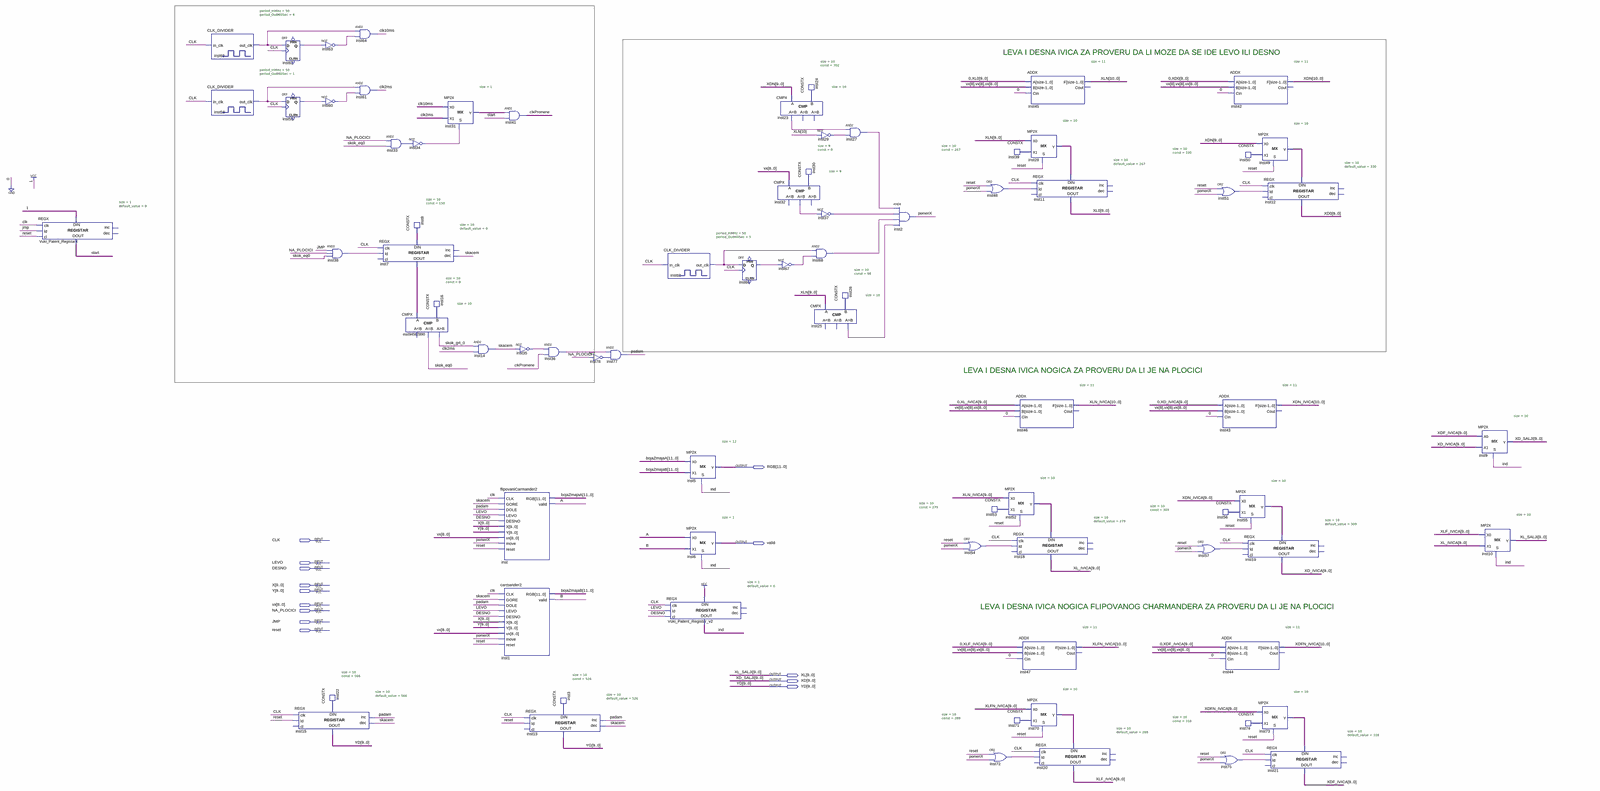
[diagram p0: schematic sheet, whole]
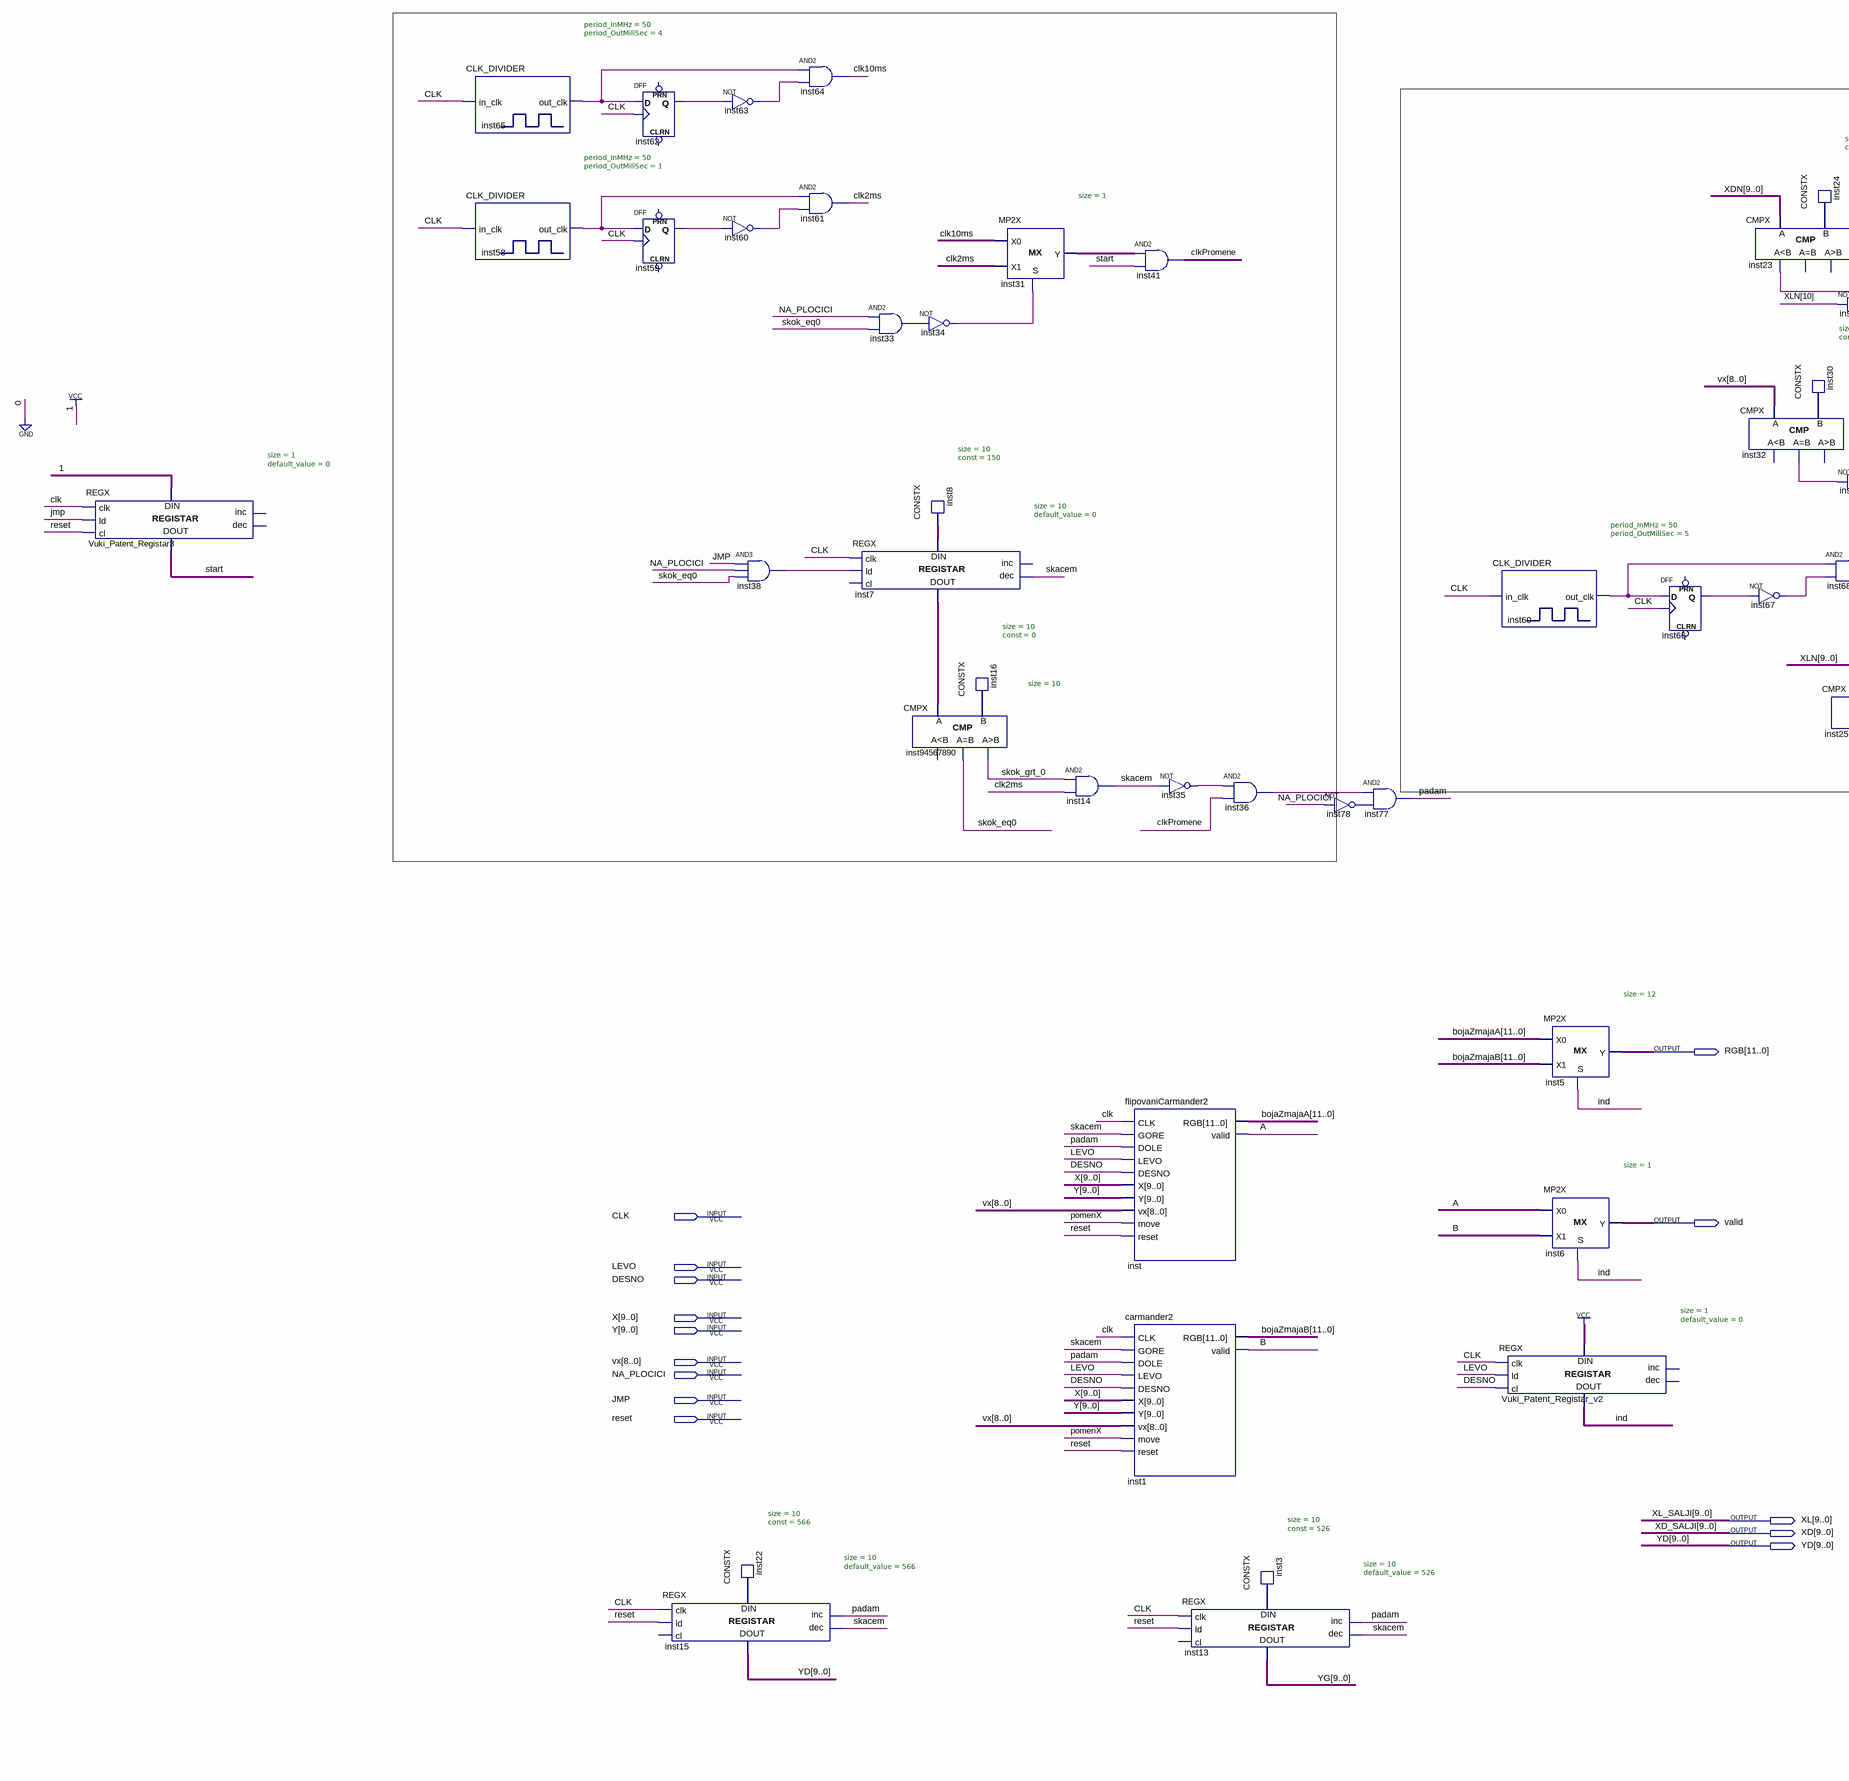
[diagram p1: schematic sheet, left part]
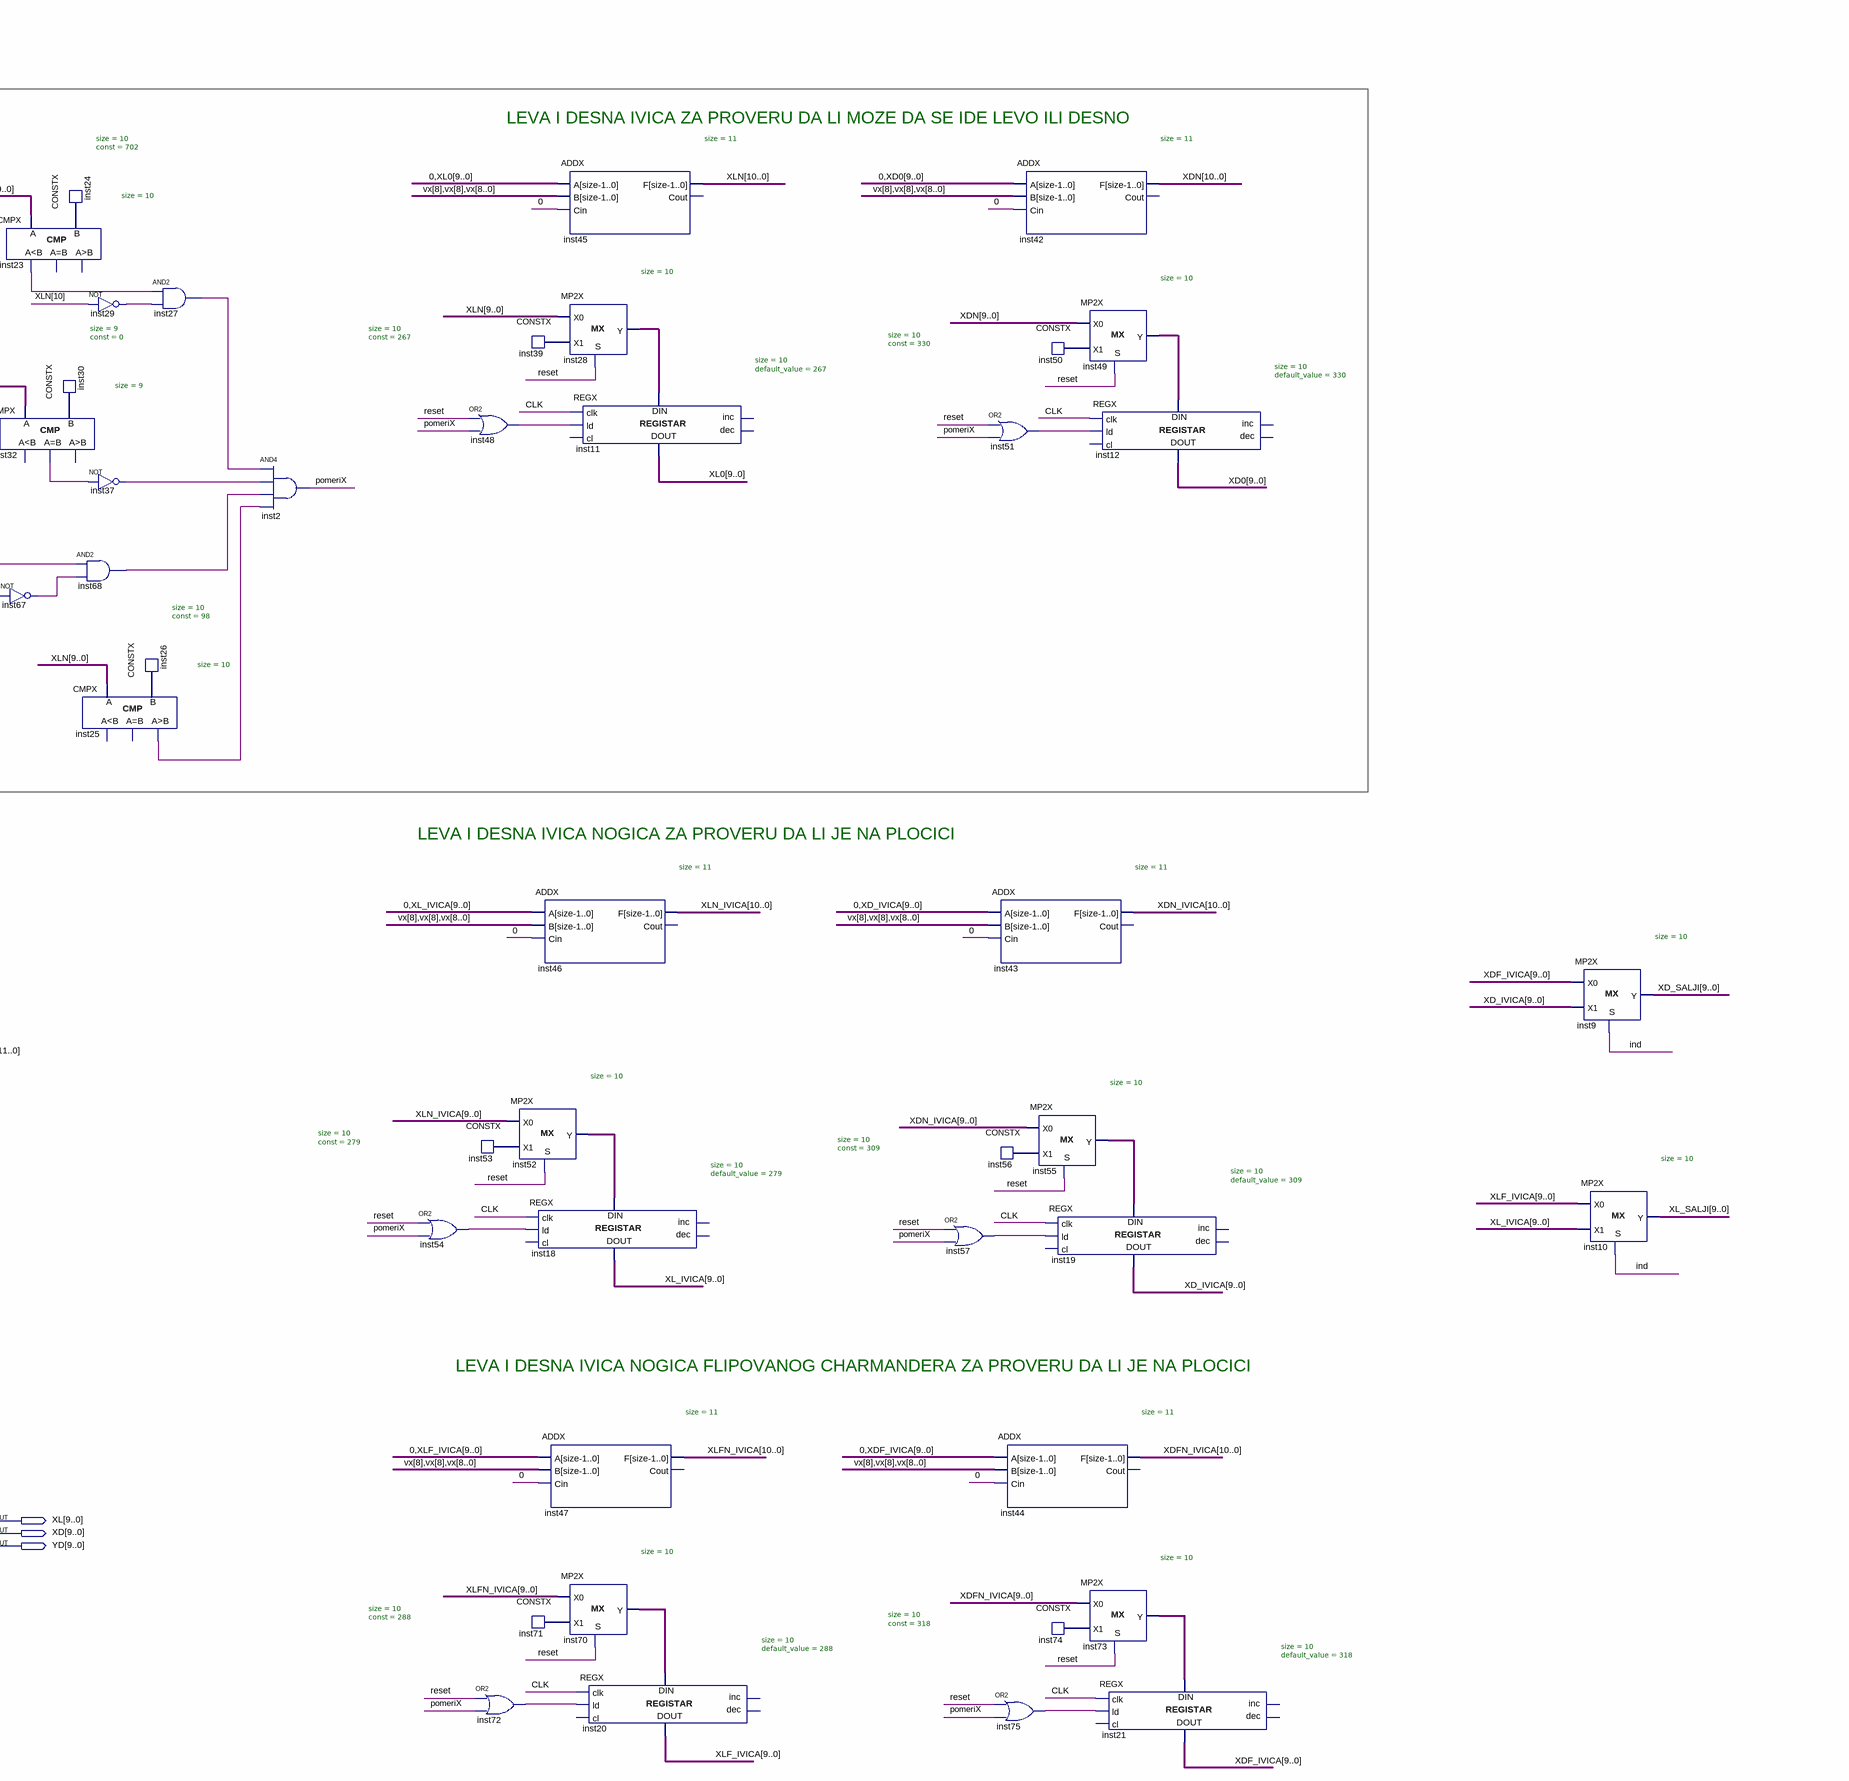
[diagram p2: schematic sheet, right part]
// Quartus schematic carmanderLevoDesno2.bdf as structural Verilog: 78 symbols, 14 pins
module carmanderLevoDesno2 (
  input  CLK,
  input  LEVO,
  input  DESNO,
  input  [9:0] X,
  input  [9:0] Y,
  input  [8:0] vx,
  input  NA_PLOCICI,
  input  JMP,
  input  reset,
  output [11:0] RGB,
  output valid,
  output [9:0] XL,
  output [9:0] XD,
  output [9:0] YD
);

  wire A, B, clk2ms, clk10ms, clkPromene, ind, inst23_ls, inst25_gr, inst27_out, inst29_out, inst31_y,
       inst32_eq, inst33_out, inst34_out, inst35_out, inst36_out, inst37_out, inst38_out, inst48_out,
       inst51_out, inst54_out, inst57_out, inst58_out_clk, inst59_q, inst60_out, inst62_q, inst63_out,
       inst65_out_clk, inst66_q, inst67_out, inst68_out, inst69_out_clk, inst72_out, inst75_out, inst78_out,
       padam, pomeriX, skacem, skok_eq0, skok_grt_0, start;
  wire [8:0] inst30_data;
  wire [9:0] inst3_data, inst7_data_out, inst8_data, inst16_data, inst22_data, inst24_data, inst26_data,
       inst28_y, inst39_data, inst49_y, inst50_data, inst52_y, inst53_data, inst55_y, inst56_data, inst70_y,
       inst71_data, inst73_y, inst74_data, XD0, XD_IVICA, XDF_IVICA, XL0, XL_IVICA, XLF_IVICA, YG;
  wire [10:0] XDFN_IVICA, XDN, XDN_IVICA, XLFN_IVICA, XLN, XLN_IVICA;
  wire [11:0] bojaZmajaA, bojaZmajaB;

  REGX #(.size(1), .default_value(0)) Vuki_Patent_Registar3 (
    .clk(CLK), .ld(JMP), .cl(reset), .data_in(1'b1), .data_out(start));  // open: inc, dec
  CLK_DIVIDER #(.period_InMHz(50), .period_OutMiliSec(4)) inst65 (.in_clk(CLK), .out_clk(inst65_out_clk));
  CLK_DIVIDER #(.period_InMHz(50), .period_OutMiliSec(1)) inst58 (.in_clk(CLK), .out_clk(inst58_out_clk));
  DFF inst62 (.CLK(CLK), .D(inst65_out_clk), .Q(inst62_q));  // open: CLRN, PRN
  DFF inst59 (.CLK(CLK), .D(inst58_out_clk), .Q(inst59_q));  // open: CLRN, PRN
  REGX #(.size(10), .default_value(566)) inst15 (
    .clk(CLK), .ld(reset), .inc(padam), .dec(skacem), .data_in(inst22_data), .data_out(YD));  // open: cl
  not inst63 (inst63_out, inst62_q);
  not inst60 (inst60_out, inst59_q);
  and inst38 (inst38_out, JMP, NA_PLOCICI, skok_eq0);
  CONSTX #(.size(10), .\const (566)) inst22 (.data(inst22_data));
  and inst64 (clk10ms, inst65_out_clk, inst63_out);
  and inst61 (clk2ms, inst58_out_clk, inst60_out);
  REGX #(.size(10), .default_value(0)) inst7 (
    .clk(CLK), .ld(inst38_out), .dec(skacem), .data_in(inst8_data), .data_out(inst7_data_out));  // open: cl, inc
  and inst33 (inst33_out, NA_PLOCICI, skok_eq0);
  CONSTX #(.size(10), .\const (150)) inst8 (.data(inst8_data));
  CMPX #(.size(10)) inst94567890 (.A(inst7_data_out), .B(inst16_data), .eq(skok_eq0), .gr(skok_grt_0));  // open: ls
  not inst34 (inst34_out, inst33_out);
  CONSTX #(.size(10), .\const (0)) inst16 (.data(inst16_data));
  MP2X #(.size(1)) inst31 (.S(inst34_out), .X0(clk10ms), .X1(clk2ms), .Y(inst31_y));
  and inst14 (skacem, skok_grt_0, clk2ms);
  and inst41 (clkPromene, inst31_y, start);
  not inst35 (inst35_out, skacem);
  flipovaniCarmander2 inst (
    .CLK(CLK), .GORE(skacem), .DOLE(padam), .LEVO(LEVO), .DESNO(DESNO), .X(X), .Y(Y), .vx(vx),
    .move(pomeriX), .reset(reset), .RGB(bojaZmajaA), .valid(A));
  carmander2 inst1 (
    .CLK(CLK), .GORE(skacem), .DOLE(padam), .LEVO(LEVO), .DESNO(DESNO), .X(X), .Y(Y), .vx(vx),
    .move(pomeriX), .reset(reset), .RGB(bojaZmajaB), .valid(B));
  REGX #(.size(10), .default_value(526)) inst13 (
    .clk(CLK), .ld(reset), .inc(padam), .dec(skacem), .data_in(inst3_data), .data_out(YG));  // open: cl
  and inst36 (inst36_out, inst35_out, clkPromene);
  CONSTX #(.size(10), .\const (526)) inst3 (.data(inst3_data));
  and inst77 (padam, inst36_out, inst78_out);
  not inst78 (inst78_out, NA_PLOCICI);
  CLK_DIVIDER #(.period_InMHz(50), .period_OutMiliSec(5)) inst69 (.in_clk(CLK), .out_clk(inst69_out_clk));
  REGX #(.size(1), .default_value(0)) Vuki_Patent_Registar_v2 (
    .clk(CLK), .ld(LEVO), .cl(DESNO), .data_in(1'b1), .data_out(ind));  // open: inc, dec
  MP2X #(.size(12)) inst5 (.S(ind), .X0(bojaZmajaA), .X1(bojaZmajaB), .Y(RGB));
  MP2X #(.size(1)) inst6 (.S(ind), .X0(A), .X1(B), .Y(valid));
  DFF inst66 (.CLK(CLK), .D(inst69_out_clk), .Q(inst66_q));  // open: CLRN, PRN
  CMPX #(.size(10)) inst23 (.A(XDN[9:0]), .B(inst24_data), .ls(inst23_ls));  // open: eq, gr
  CMPX #(.size(9)) inst32 (.A(vx), .B(inst30_data), .eq(inst32_eq));  // open: ls, gr
  not inst67 (inst67_out, inst66_q);
  CONSTX #(.size(10), .\const (702)) inst24 (.data(inst24_data));
  CONSTX #(.size(9), .\const (0)) inst30 (.data(inst30_data));
  and inst68 (inst68_out, inst69_out_clk, inst67_out);
  CMPX #(.size(10)) inst25 (.A(XLN[9:0]), .B(inst26_data), .gr(inst25_gr));  // open: ls, eq
  not inst29 (inst29_out, XLN[10]);
  not inst37 (inst37_out, inst32_eq);
  CONSTX #(.size(10), .\const (98)) inst26 (.data(inst26_data));
  and inst27 (inst27_out, inst23_ls, inst29_out);
  and inst2 (pomeriX, inst27_out, inst37_out, inst68_out, inst25_gr);
  or inst54 (inst54_out, reset, pomeriX);
  or inst48 (inst48_out, reset, pomeriX);
  CONSTX #(.size(10), .\const (279)) inst53 (.data(inst53_data));
  or inst72 (inst72_out, reset, pomeriX);
  CONSTX #(.size(10), .\const (267)) inst39 (.data(inst39_data));
  ADDX #(.size(11)) inst46 (.A({1'b0, XL_IVICA}), .B({{3{vx[8]}}, vx[7:0]}), .Cin(1'b0), .F(XLN_IVICA));  // open: Cout
  MP2X #(.size(10)) inst52 (.S(reset), .X0(XLN_IVICA[9:0]), .X1(inst53_data), .Y(inst52_y));
  REGX #(.size(10), .default_value(279)) inst18 (
    .clk(CLK), .ld(inst54_out), .data_in(inst52_y), .data_out(XL_IVICA));  // open: cl, inc, dec
  CONSTX #(.size(10), .\const (288)) inst71 (.data(inst71_data));
  ADDX #(.size(11)) inst45 (.A({1'b0, XL0}), .B({{3{vx[8]}}, vx[7:0]}), .Cin(1'b0), .F(XLN));  // open: Cout
  MP2X #(.size(10)) inst28 (.S(reset), .X0(XLN[9:0]), .X1(inst39_data), .Y(inst28_y));
  REGX #(.size(10), .default_value(267)) inst11 (
    .clk(CLK), .ld(inst48_out), .data_in(inst28_y), .data_out(XL0));  // open: cl, inc, dec
  ADDX #(.size(11)) inst47 (
    .A({1'b0, XLF_IVICA}), .B({{3{vx[8]}}, vx[7:0]}), .Cin(1'b0), .F(XLFN_IVICA));  // open: Cout
  MP2X #(.size(10)) inst70 (.S(reset), .X0(XLFN_IVICA[9:0]), .X1(inst71_data), .Y(inst70_y));
  REGX #(.size(10), .default_value(288)) inst20 (
    .clk(CLK), .ld(inst72_out), .data_in(inst70_y), .data_out(XLF_IVICA));  // open: cl, inc, dec
  or inst51 (inst51_out, reset, pomeriX);
  ADDX #(.size(11)) inst43 (.A({1'b0, XD_IVICA}), .B({{3{vx[8]}}, vx[7:0]}), .Cin(1'b0), .F(XDN_IVICA));  // open: Cout
  CONSTX #(.size(10), .\const (309)) inst56 (.data(inst56_data));
  or inst57 (inst57_out, reset, pomeriX);
  ADDX #(.size(11)) inst42 (.A({1'b0, XD0}), .B({{3{vx[8]}}, vx[7:0]}), .Cin(1'b0), .F(XDN));  // open: Cout
  CONSTX #(.size(10), .\const (330)) inst50 (.data(inst50_data));
  MP2X #(.size(10)) inst55 (.S(reset), .X0(XDN_IVICA[9:0]), .X1(inst56_data), .Y(inst55_y));
  ADDX #(.size(11)) inst44 (
    .A({1'b0, XDF_IVICA}), .B({{3{vx[8]}}, vx[7:0]}), .Cin(1'b0), .F(XDFN_IVICA));  // open: Cout
  CONSTX #(.size(10), .\const (318)) inst74 (.data(inst74_data));
  or inst75 (inst75_out, reset, pomeriX);
  MP2X #(.size(10)) inst49 (.S(reset), .X0(XDN[9:0]), .X1(inst50_data), .Y(inst49_y));
  REGX #(.size(10), .default_value(330)) inst12 (
    .clk(CLK), .ld(inst51_out), .data_in(inst49_y), .data_out(XD0));  // open: cl, inc, dec
  REGX #(.size(10), .default_value(309)) inst19 (
    .clk(CLK), .ld(inst57_out), .data_in(inst55_y), .data_out(XD_IVICA));  // open: cl, inc, dec
  MP2X #(.size(10)) inst73 (.S(reset), .X0(XDFN_IVICA[9:0]), .X1(inst74_data), .Y(inst73_y));
  REGX #(.size(10), .default_value(318)) inst21 (
    .clk(CLK), .ld(inst75_out), .data_in(inst73_y), .data_out(XDF_IVICA));  // open: cl, inc, dec
  MP2X #(.size(10)) inst9 (.S(ind), .X0(XDF_IVICA), .X1(XD_IVICA), .Y(XD));
  MP2X #(.size(10)) inst10 (.S(ind), .X0(XLF_IVICA), .X1(XL_IVICA), .Y(XL));

  // Other names for the same wires on the sheet: XD_SALJI[9:0] = XD; XL_SALJI[9:0] = XL

  // Notes on the sheet:
  //   LEVA I DESNA IVICA ZA PROVERU DA LI MOZE DA SE IDE LEVO ILI DESNO
  //   LEVA I DESNA IVICA NOGICA ZA PROVERU DA LI JE NA PLOCICI
  //   LEVA I DESNA IVICA NOGICA FLIPOVANOG CHARMANDERA ZA PROVERU DA LI JE NA PLOCICI
endmodule
